# Altium schematic sheet Power.SchDoc
size A4; SheetNumber: 3; SheetTotal: 3
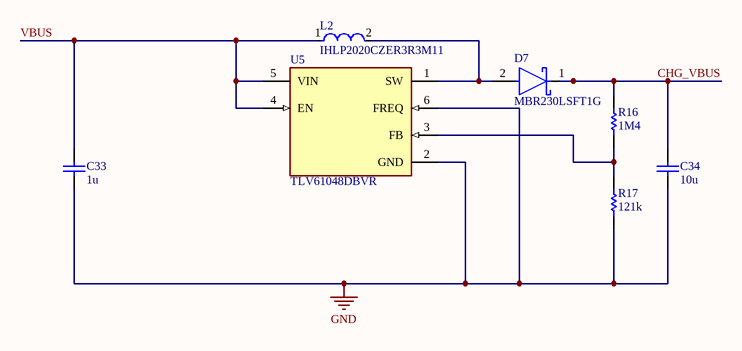
[diagram p0: Power.SchDoc]

## Parts
C33  1u  [CAPC2013X145X50ML20T25]
C34  10u  [CAPC2013X145X50ML20T25]
D7  MBR230LSFT1G  [FP-498-MFG]
L2  IHLP2020CZER3R3M11  [FP-IHLP-2020CZ-FP_1_905x2-MFG]
R16  1M4  [RESC1608X55X25ML10T15]
R17  121k  [RESC1608X55X25ML10T15]
U5  TLV61048DBVR  [FP-DBV0006A-IPC_B]

## Nets
GND: C33.1 C34.1 R17.1 U5.2(GND) U5.6(FREQ)
CHG_VBUS: C34.2 D7.1(C) R16.2
VBUS: C33.2 L2.1 U5.4(EN) U5.5(VIN)
NetD7_2: D7.2(A) L2.2 U5.1(SW)
NetR16_1: R16.1 R17.2 U5.3(FB)

## Library data of the parts
C33 C34 = CMP-1036-04819-2: Part Number: C0805C225K9PACTU; Manufacturer: Kemet
D7 = CMP-1055-00442-2: DIODE SCHOTTKY 30V 2A SOD123L; Max Forward Surge Current (Ifsm): 40A; Element Configuration: Single; Forward Voltage: 430mV; Peak Reverse Current: 1mA; Max Reverse Voltage (DC): 30V; Max Operating Temperature: 125°C; Max Repetitive Reverse Voltage (Vrrm): 30V; Forward Current: 2A; Package Quantity: 1; Height: 0.9mm; REACH SVHC: No SVHC; Contact Plating: Tin; Min Operating Temperature: -55°C; Lead Free: Lead Free; Average Rectified Current: 2A; Halogen Free: Halogen Free; Peak Non-Repetitive Surge Current: 40A; Radiation Hardening: No; Case/Package: SOD; Number of Pins: 2; Packaging: Tape and Reel; Width: 1.8mm; Length: 2.9mm
L2 = CMP-02424-000463-1: Fixed Inductors Commercial Low DCR Series 3.3uH 5.5A 40.4mΩ 20%; DC Resistance (DCR): 40.4mR; Self Resonant Frequency: 29MHz; Saturation Current: 7A; Test Frequency: 100kHz; Shielding: Shielded; Depth: 5.43mm; Inductance: 3.3uH; Termination: SMD/SMT; Width: 0.204inch; Packaging: Tape and Reel; Height: 3mm; Height - Seated (Max): 0.118inch; Military Standard: Not; RMS Current (Irms): 5.5A; Current Rating: 5.5A; Radiation Hardening: No; Case/Package: 2020; Tolerance: 20%; Min Operating Temperature: -55°C; Package Quantity: 2000; Contact Plating: Tin; Mount: Surface Mount; Inductance Tolerance: 20%; Length: 5.74mm; Lead Free: Lead Free; Max DC Current: 7A; Max Operating Temperature: 125°C
R16 R17 = CMP-2100-03667-1: Chip Resistor, 0 Ohm, +/- 5%, 0.1 W, -55 to 155 degC, 0603 (1608 Metric), RoHS, Tape and Reel; Manufacturer: Yageo; Temperature Coefficient: 200ppm/degreesC; Voltage Rating: 50V; Power Rating: 100mW; Resistance: 0mOhm; Width: 0.8mm; Max Operating Temperature: 155degC; Tolerance: 5%; Package Reference: 0603; Height: 0.45mm; Depth: 0.8mm; Package Description: 2-Pin Surface Mount Device, Body 1.6 x 0.8 mm; Termination: SMD/SMT; Package Quantity: 5000; Case/Package: 0603; Case Code (Imperial): 0603; Radiation Hardening: No; Number of Pins: 2; Length: 1.6mm; Lead Free: LeadFree; Voltage Rating (DC): 50V; Military Standard: Not; Datasheet URL: http://www.yageo.com/NewPortal/yageodocoutput?fileName=/pdf/R-Chip/PYu-RC_Group_51_RoHS_L_5.pdf; Manufacturer URL: http://www.yageo.com/; Packaging: TapeandReel; Case Code (Metric): 1608; Min Operating Temperature: -55degC; Composition: ThickFilm; RoHSCompliant: true; Contact Plating: Tin; Datasheet Version: Rev. 5, 10/2016; REACH SVHC: NoSVHC
U5 = CMP-04918-000262-1: IC REG BOOST ADJ SOT23-6